# EAGLE board 612_jetracer_pico_300 (EAGLE 9.6.0)
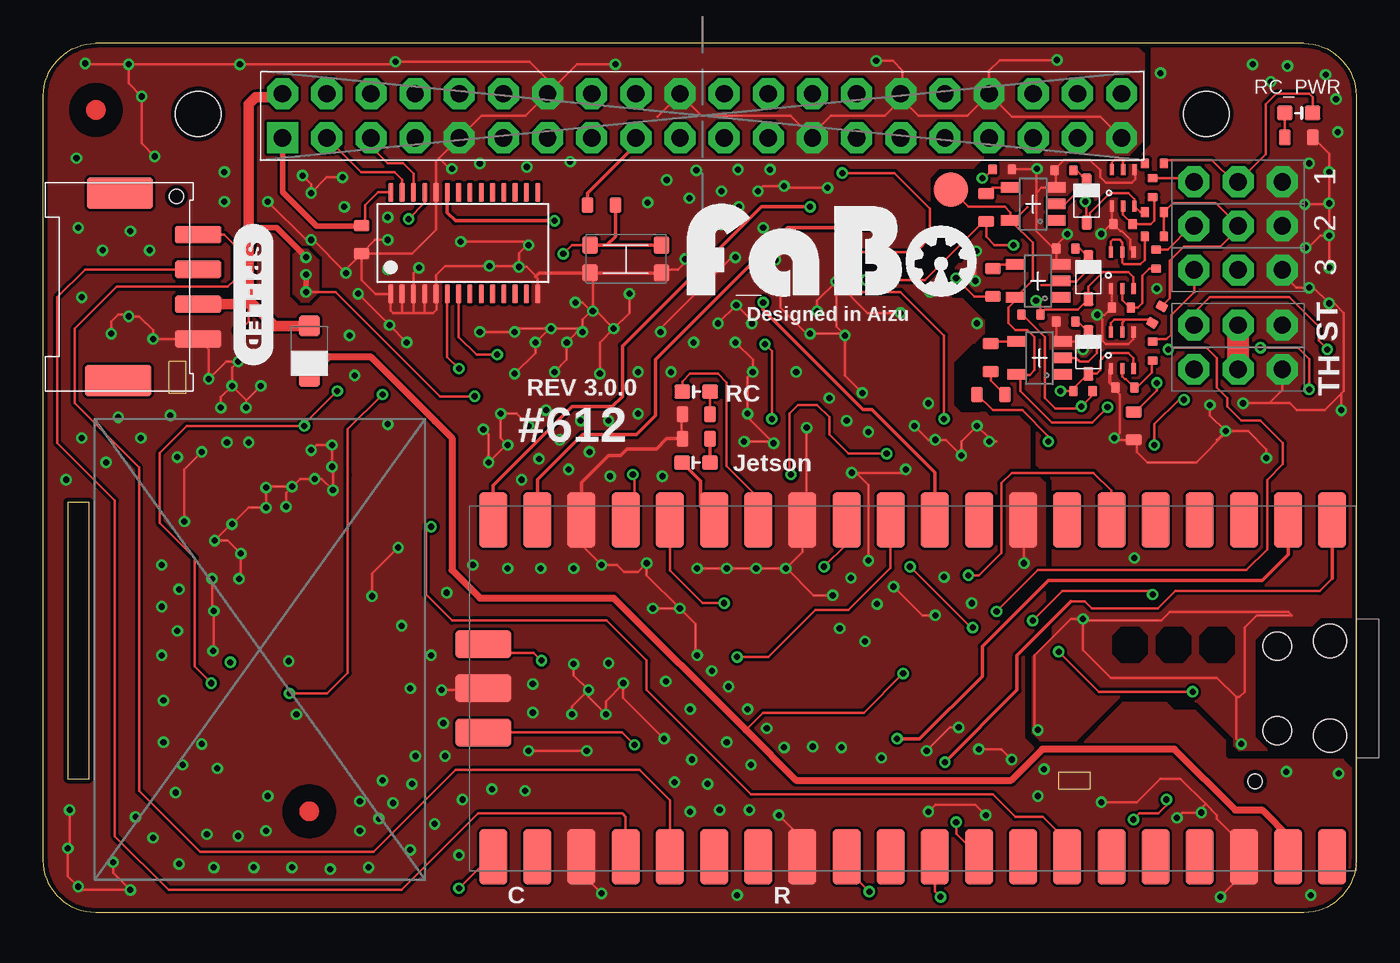
[diagram p7: board, top side]
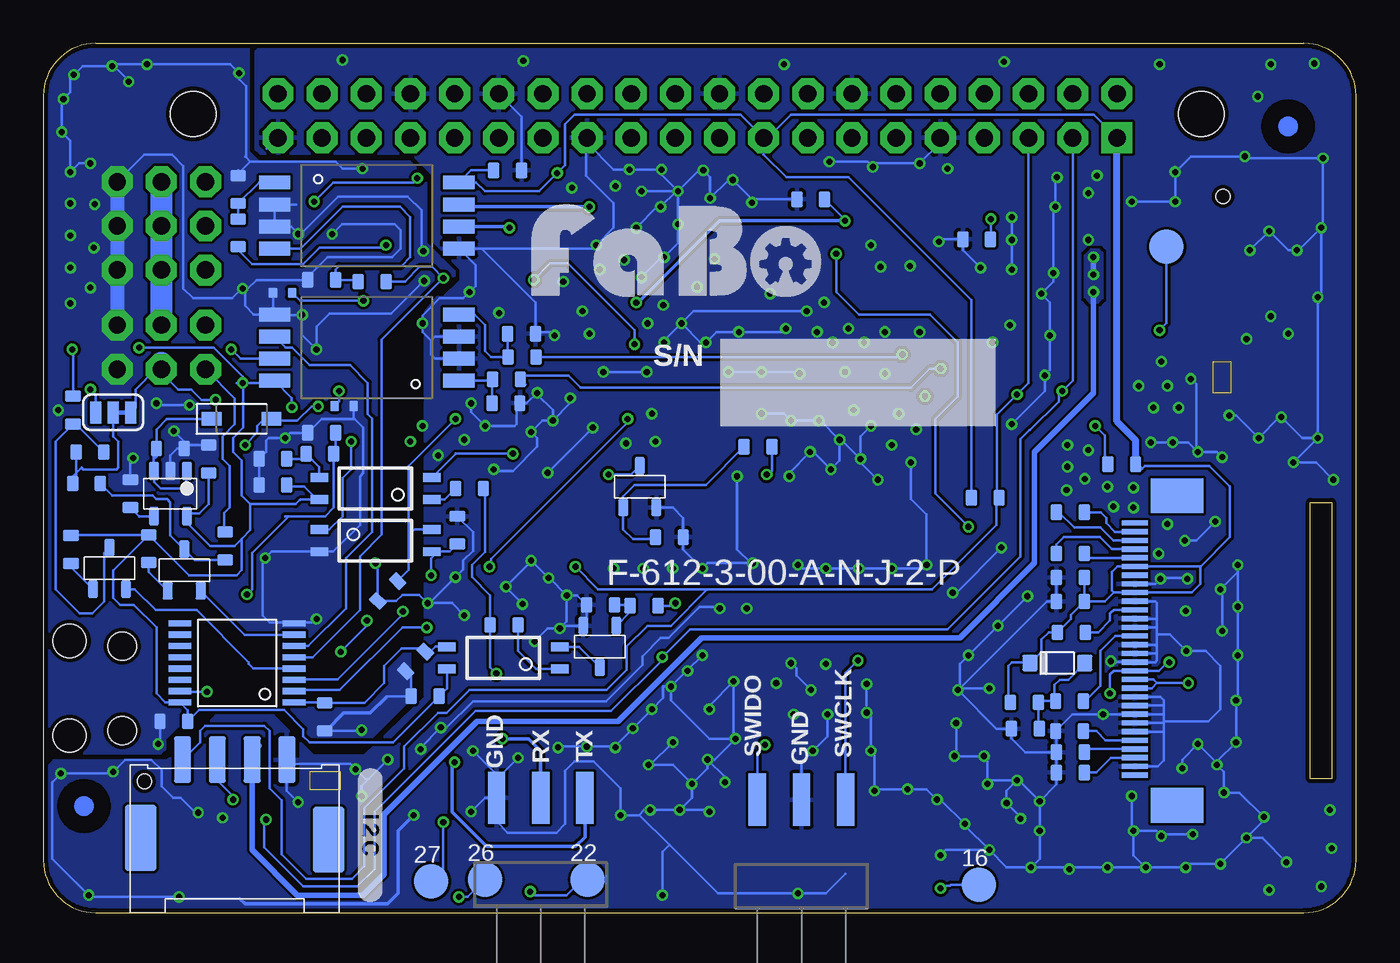
[diagram p8: board, bottom side, seen from below]

Size 75.5 x 50 mm. Coordinates in mm from the lower left corner, seen from the top.
Outline: 1.4,23.6 1.4,7.7 2.62,7.7 2.62,23.6 1.4,23.6
Outline: 72.5,0 3,0 arc-90 0,3 0,47 arc-90 3,50 72.5,50 arc-90 75.5,47 75.5,3 arc-90 72.5,0
Copper layers (1*16): Top 0.035mm / dielectric 1.6mm / Bottom 0.035mm
Design rules "PCBway": minimum track width 6mil, minimum drill 12mil, track to track 6mil, track to pad 6mil, pad to pad 6mil, via to via 6mil, smd to smd 6mil, copper to edge 10mil, drill to drill 10mil, minimum pad ring 10mil, minimum via ring 6mil, stop-mask expansion 2mil, vias tented up to drill 100mil, thermal gap 8mil
Holes 2.6 mm at 66.9,45.95 8.9,45.95
tKeepout: area 2.8,1.7 to 21.9,28.5; area 24.6,2.3 to 75.5,23.4
bKeepout: area 43,10.8 to 47,14.6
bRestrict: 7 lines

## Footprints (pad centres in the part's own frame; a part is rotated, then mirrored left to right if it is on the bottom)
FABO_BRICK_3PIN_HEADER = drill 1 pad 1.778 octagon: GND -2.54,0; I/O 2.54,0; VCC 0,0
TESTPAD_TP20R = smd 2 x 2: TP 0,0
0603 = smd 0.65 x 0.9: 1 -0.8,0; 2 0.8,0
1N4148W = smd 0.9 x 0.95: ANODE 0,0; CATHODE 3.15,0
SOD-323 = smd 0.8 x 0.6: A -1.2,0; K 1.2,0
SOD3715X135 = smd 1.127 x 0.784: 1 -1.722,0; 2 1.722,0
SOD123W = smd 1.2 x 1.2: 1 -1.45,0; 2 1.45,0
I2C-BM04B-PASS-1 = smd 1 x 2.7: 5V -1,0; GND -3,0; SCL 3,0; SDA 1,0 | smd 1.8 x 3.8: P$5 -5.4,4.6; P$6 5.4,4.5 | hole 0.8: 5.2,1.25
JETSON_NANO_NOBOARDER = drill 1 pad 1.778 square: 1 1.27,1.27 | drill 1 pad 1.778 octagon: 2 1.27,3.81; 3 3.81,1.27; 4 3.81,3.81; 5 6.35,1.27; 6 6.35,3.81; 7 8.89,1.27; 8 8.89,3.81; 9 11.43,1.27; 10 11.43,3.81; 11 13.97,1.27; 12 13.97,3.81; 13 16.51,1.27; 14 16.51,3.81; 15 19.05,1.27; 16 19.05,3.81; 17 21.59,1.27; 18 21.59,3.81; 19 24.13,1.27; 20 24.13,3.81; 21 26.67,1.27; 22 26.67,3.81; 23 29.21,1.27; 24 29.21,3.81; 25 31.75,1.27; 26 31.75,3.81; 27 34.29,1.27; 28 34.29,3.81; 29 36.83,1.27; 30 36.83,3.81; 31 39.37,1.27; 32 39.37,3.81; 33 41.91,1.27; 34 41.91,3.81; 35 44.45,1.27; 36 44.45,3.81; 37 46.99,1.27; 38 46.99,3.81; 39 49.53,1.27; 40 49.53,3.81
TSSOP-16 = smd 0.36 x 1.3: 1 -2.275,-3.28; 2 -1.625,-3.28; 3 -0.975,-3.28; 4 -0.325,-3.28; 5 0.325,-3.28; 6 0.975,-3.28; 7 1.625,-3.28; 8 2.275,-3.28; 9 2.275,3.28; 10 1.625,3.28; 11 0.975,3.28; 12 0.325,3.28; 13 -0.325,3.28; 14 -0.975,3.28; 15 -1.625,3.28; 16 -2.275,3.28
PCA9685 = smd 0.3 x 1.1: 1 -4.15,-2.93; 2 -3.5,-2.93; 3 -2.85,-2.93; 4 -2.2,-2.93; 5 -1.55,-2.93; 6 -0.9,-2.93; 7 -0.25,-2.93; 8 0.4,-2.93; 9 1.05,-2.93; 10 1.7,-2.93; 11 2.35,-2.93; 12 3,-2.93; 13 3.65,-2.93; 14 4.3,-2.93; 15 4.3,2.92; 16 3.65,2.92; 17 3,2.92; 18 2.35,2.92; 19 1.7,2.92; 20 1.05,2.92; 21 0.4,2.92; 22 -0.25,2.92; 23 -0.9,2.92; 24 -1.55,2.92; 25 -2.2,2.92; 26 -2.85,2.92; 27 -3.5,2.92; 28 -4.15,2.92
SOT-23-5 = smd 0.6 x 1.05: 1 -0.95,-1.3; 2 0,-1.3; 3 0.95,-1.3; 4 0.95,1.3; 5 -0.95,1.3
1X03_SMD_RA_MALE = smd 1 x 3: 1 -2.54,5; 2 0,5; 3 2.54,5
0603' = smd 0.9 x 0.8: ANODE -0.8,0; CATHODE 0.8,0
SMT-JUMPER_3_1-NC_TRACE_SILK = smd 0.635 x 1.27: 1 -1.016,0; 2 0,0; 3 1.016,0
SPI-BM04B-PASS-1 = smd 1 x 2.7: 5V -1,-0.1; CI 1,-0.1; DI 3,-0.1; GND -3,-0.1 | smd 1.8 x 3.8: P$5 -5.4,4.5; P$6 5.4,4.4 | hole 0.8: 5.2,1.15
0402 = smd 0.5 x 0.6: 1 -0.55,0; 2 0.55,0
KMR2 = smd 0.9 x 1: 1 -2.05,0.8; 2 2.05,0.8; 3 2.05,-0.8; 4 -2.05,-0.8
SOT-23 = smd 0.6 x 1: 1 -0.95,-1.2; 2 0.95,-1.2; 3 0,1.2
ER-CON30HT-1 = smd 0.3 x 1.5 bottom: 1 7,-0.23; 2 6.5,-0.23; 3 6,-0.23; 4 5.5,-0.23; 5 5,-0.23; 6 4.5,-0.23; 7 4,-0.23; 8 3.5,-0.23; 9 3,-0.23; 10 2.5,-0.23; 11 2,-0.23; 12 1.5,-0.23; 13 1,-0.23; 14 0.5,-0.23; 15 0,-0.23; 16 -0.5,-0.23; 17 -1,-0.23; 18 -1.5,-0.23; 19 -2,-0.23; 20 -2.5,-0.23; 21 -3,-0.23; 22 -3.5,-0.23; 23 -4,-0.23; 24 -4.5,-0.23; 25 -5,-0.23; 26 -5.5,-0.23; 27 -6,-0.23; 28 -6.5,-0.23; 29 -7,-0.23; 30 -7.5,-0.23 | smd 2 x 3 bottom: 31 -9.07,-2.67; 32 8.74,-2.67
RASPBERRY_PI_PICO_SMD = smd 3.2 x 1.6: 1 -9.69,24.13; 2 -9.69,21.59; 3 -9.69,19.05; 4 -9.69,16.51; 5 -9.69,13.97; 6 -9.69,11.43; 7 -9.69,8.89; 8 -9.69,6.35; 9 -9.69,3.81; 10 -9.69,1.27; 11 -9.69,-1.27; 12 -9.69,-3.81; 13 -9.69,-6.35; 14 -9.69,-8.89; 15 -9.69,-11.43; 16 -9.69,-13.97; 17 -9.69,-16.51; 18 -9.69,-19.05; 19 -9.69,-21.59; 20 -9.69,-24.13; 21 9.69,-24.13; 22 9.69,-21.59; 23 9.69,-19.05; 24 9.69,-16.51; 25 9.69,-13.97; 26 9.69,-11.43; 27 9.69,-8.89; 28 9.69,-6.35; 29 9.69,-3.81; 30 9.69,-1.27; 31 9.69,1.27; 32 9.69,3.81; 33 9.69,6.35; 34 9.69,8.89; 35 9.69,11.43; 36 9.69,13.97; 37 9.69,16.51; 38 9.69,19.05; 39 9.69,21.59; 40 9.69,24.13 | smd 1.6 x 3.2: D1 -2.54,-24.7; D2 0,-24.7; D3 2.54,-24.7 | hole 1.9: 2.725,24; -2.725,24 | hole 1.6: 2.425,20.97; -2.425,20.97
11-3C1 = smd 1 x 0.5: 1 -3.24,0.635; 2 -3.24,-0.635; 3 3.24,-0.635; 4 3.24,0.635
TLP2270 = smd 0.8 x 1.8: 1 -1.905,-5.3; 2 -0.635,-5.3; 3 0.635,-5.3; 4 1.905,-5.3; 5 1.905,5.3; 6 0.635,5.3; 7 -0.635,5.3; 8 -1.905,5.3
US6 = smd 0.3 x 0.635: 1 -0.65,-1.05; 2 0,-1.05; 3 0.65,-1.05; 4 0.65,1.05; 5 0,1.05; 6 -0.65,1.05
SOT-23' = smd 1.1 x 0.6: 1 -1.3,0.95; 2 -1.3,0; 3 -1.3,-0.95; 4 1.3,-0.95; 5 1.3,0.95

## Placement (x,y rotation side)
1  [FABO_BRICK_3PIN_HEADER]  68.72,42.05 180 top
2  [FABO_BRICK_3PIN_HEADER]  68.72,39.51 180 top
3  [FABO_BRICK_3PIN_HEADER]  68.72,36.97 180 top
16  TESTPAD_TPSQTP20R  [TESTPAD_TP20R]  21.7,1.6 0 bottom
22  TESTPAD_TPSQTP20R  [TESTPAD_TP20R]  44.2,1.9 0 bottom
26  TESTPAD_TPSQTP20R  [TESTPAD_TP20R]  50.1,1.9 0 bottom
27  TESTPAD_TPSQTP20R  [TESTPAD_TP20R]  53.2,1.8 0 bottom
C1  0.1uF  [0603]  62.3,24.6 0 bottom
C2  10uF  [0603]  18.3,38.72 90 top
C3  0.1uF  [0603]  68,11 0 bottom
C4  1uF  [0603]  16.43,20.66 180 bottom
C5  1uF  [0603]  16.43,23.03 0 bottom
C6  1uF  [0603]  16.43,17.91 0 bottom
C7  1uF  [0603]  16.43,19.28 0 bottom
C8  10uF  [0603]  16.43,8.05 0 bottom
C9  10uF  [0603]  16.43,9.23 0 bottom
C10  1uF  [0603]  68.2,26.7 180 bottom
C11  10uF  [0603]  19.02,10.58 0 bottom
C12  0.1uF  [0603]  53.55,12.45 0 bottom
C16  0.1uF  [0603]  48.8,42.7 180 bottom
C17  0.1uF  [0603]  62.7,28 90 top
C18  0.1uF  [0603]  55.7,18.5 45 bottom
C22  4.7uF  [0603]  66,26.1 270 bottom
C23  0.01uF  [0603]  70.5,24.1 270 bottom
D1  1N4148  [1N4148W]  15.6,14.36 180 bottom
D2  [SOD-323]  60.1,32.2 90 top
D3  [SOD-323]  60,40.9 90 top
D5  1N4148W  [SOD3715X135]  64.1,28.4 0 bottom
D6  [SOD-323]  60.1,36.5 90 top
D10  PMEG2010ER  [SOD123W]  15.3,32.3 90 top
I2C  FABO-I2C_BM04B  [I2C-BM04B-PASS-1]  64.5,8.8 180 bottom
IC2  JETSON_NANO_NOBORDER  [JETSON_NANO_NOBOARDER]  12.48,43.3 0 top
IC3  MULTIPLEXERSMC74HC157A  [TSSOP-16]  64.36,14.36 90 bottom
IC4  [PCA9685]  24.13,38.52 0 top
IC5  [SOT-23-5]  68.2,24.1 180 bottom
J1  [1X03_SMD_RA_MALE]  46.9,1.6 0 bottom
J2  [1X03_SMD_RA_MALE]  31.9,1.5 0 bottom
JETSON  GREEN  [0603']  37.54,25.89 0 top
JETSON1  RED  [0603']  37.55,29.97 0 top
JP2  JUMPER-SMT_3_1-NC_TRACE_SILK  [SMT-JUMPER_3_1-NC_TRACE_SILK]  71.49,28.77 0 bottom
LED-SPI  [SPI-BM04B-PASS-1]  8.8,36 90 top
R1  10K  [0603]  21.82,38.73 0 bottom
R2  220  [0603]  34.4,26.8 180 bottom
R3  10K  [0603]  31.37,41.03 0 bottom
R4  1K/0402  [0402]  63.9,43.1 0 top
R5  470  [0603]  37.55,28.66 0 top
R6  1K/0402  [0402]  63.9,40.3 0 top
R7  10K  [0603]  21.33,23.87 0 bottom
R8  100  [0603]  16.48,12.17 0 bottom
R9  10K  [0603]  13.48,25.8 180 bottom
R10  1K  [0603]  37.55,27.26 0 top
R11  0  [0603]  69.44,20.93 90 bottom
R12  220  [0603]  51,24.4 180 bottom
R13  10K  [0603]  39.5,21.6 0 bottom
R14  10K  [0603]  73.03,24.69 180 bottom
R15  1K/0402  [0402]  63.9,38.9 0 top
R16  10K  [0603]  59.33,11.26 90 bottom
R17  47  [0603]  73.8,28.91 270 bottom
R18  0  [0603]  73.92,20.89 90 bottom
R19  10K  [0603]  72.83,26.49 180 bottom
R20  47  [0603]  65.05,21.09 270 bottom
R21  1K/0402  [0402]  56.8,34.4 180 top
R22  10K  [0603]  16.38,16.12 0 bottom
R23  10K  [0603]  19.08,12.1 0 bottom
R24  4.7K/0402  [0402]  58.8,38.2 0 top
R25  0  [0603]  54.62,36.25 270 top
R26  1K/0402  [0402]  59.8,30 0 top
R27  4.7K/0402  [0402]  58.7,42.7 0 top
R28  100/0402  [0402]  63.8,41.7 270 top
R29  0  [0603]  54.23,40.56 270 top
R30  100/0402  [0402]  64,37.6 270 top
R31  4.7K/0402  [0402]  58.8,34 0 top
R32  0  [0603]  54.48,31.93 270 top
R33  330  [0603]  48.87,30.68 0 bottom
R34  330  [0603]  47.97,31.95 0 bottom
R35  390K  [0603]  16.48,10.44 180 bottom
R36  10K  [0603]  62.3,26.1 180 bottom
R37  100/0402  [0402]  63.8,32.3 270 top
R38  100K/0402  [0402]  62.1,39.6 0 top
R39  100K/0402  [0402]  62.2,30.2 0 top
R40  100K/0402  [0402]  62,34.8 0 top
R41  DNP  [0603]  32.1,40.7 180 top
R42  1K  [0603]  72.2,44.6 180 top
R43  330  [0603]  64.3,39.1 270 bottom
R44  330  [0603]  56.6,36.3 0 bottom
R45  220  [0603]  54.5,29.8 0 top
R46  4.7K  [0603]  51.7,22 270 bottom
R47  10K  [0603]  48.9,29.3 0 bottom
R48  10K  [0603]  48,33.3 0 bottom
R49  10K  [0603]  64.3,41.6 270 bottom
R50  10K  [0603]  59.5,36.4 0 bottom
R51  0  [0603]  59.5,27.6 0 bottom
R52  DNF  [0603]  59.6,26.4 180 bottom
R53  1K/0402  [0402]  64.05,34.4 60 top
R54  4.7K/0402  [0402]  55.15,42.75 180 top
R55  4.7K/0402  [0402]  61.75,35.65 0 bottom
R56  4.7K/0402  [0402]  58.2,29.15 180 bottom
R57  220  [0603]  40.95,17.65 180 bottom
R58  220  [0603]  49,16.55 0 bottom
R59  10K  [0603]  43.45,17.7 180 bottom
R60  10K  [0603]  54.1,14.45 225 bottom
RC_3V3  TESTPAD_TPSQTP20R  [TESTPAD_TP20R]  52.2,41.6 0 top
RC_PWR  ORANGE  [0603']  72.2,46 180 top
ST  [FABO_BRICK_3PIN_HEADER]  68.72,33.8 180 top
SW1  [KMR2]  33.5,37.6 180 top
T1  [SOT-23]  43.5,15.3 180 bottom
T2  [SOT-23]  41.2,24.5 0 bottom
TH  [FABO_BRICK_3PIN_HEADER]  68.72,31.25 180 top
TP1  TESTPAD_TPSQTP20R  [TESTPAD_TP20R]  10.9,38.3 0 bottom
U1  [ER-CON30HT-1]  12.96,14.91 270 top
U2  [RASPBERRY_PI_PICO_SMD]  50,12.9 270 top
U3  TLP291A  [11-3C1]  56.4,24.4 180 bottom
U4  TLP291A  [11-3C1]  49.05,14.65 180 bottom
U7  TLP291A  [11-3C1]  56.4,21.4 0 bottom
U$1  [MARK_POINT_3MM]  3.02,46.17 270 top
U$2  [MARK_POINT_3MM]  3.9,45.23 90 bottom
U$3  [MARK_POINT_3MM]  73.17,6.12 90 bottom
U$4  [LOGO_FABO_L_BOTTOM]  38.95,35 0 top
U$5  TLP2270  [TLP2270]  56.9,32.5 90 bottom
U$8  TLP2270  [TLP2270]  56.9,40.1 270 bottom
U$9  SSM6N7002KFU  [US6]  62.1,41.7 0 top
U$11  SSM6N7002KFU  [US6]  62.05,36.95 0 top
U$14  SN74LVC1G17  [SOT-23']  56.92,40.76 180 top
U$20  SN74LVC1G17  [SOT-23']  57.2,36.34 180 top
U$21  SSM6N7002KFU  [US6]  62.05,32.35 0 top
U$23  SN74LVC1G17  [SOT-23']  57.3,31.91 180 top
U$27  T2N7002AK  [SOT-23]  67.4,19.7 0 bottom
U$28  T2N7002AK  [SOT-23]  71.7,19.8 0 bottom
U$29  [MARK_POINT_3MM]  15.29,5.83 90 top
U$30  [LOGO_FABO_L]  44.65,35.45 0 top

## Tracks (layer width: path | path; a pad name or v marks a point on that pad's centre or on a via)
3V3  (via drill 0.35)
  Top 0.152: C2.2 18.3,39.5 | 18.5,39.6 18.5,40.7 19.24,41.44 IC4.28 | v51.8,28.4 51.8,33.2 49.3,35.7 47.1,35.7 46.4,36.4 46.4,37.5 46.9,38 50.2,38 51,38.8 51,40.5 48.95,42.55 v45.95,42.55
  Top 0.2: R41.2 31.3,41.4 34.08,44.17 IC2.17
  Top 0.305: IC2.1 13.76,41.45 15.7,39.5 18.3,39.5 18.41,39.5 18.5,39.6
  Bottom 0.152: 12.45,25.4 12.3,25.55 | 12.3,25.55 12.15,25.7 8.45,25.7 7.25,24.5 7.25,21.6 8.94,19.91 8.95,19.91 | 8.95,19.91 U1.25 13.74,19.91 14.05,19.6 14.05,18.52 13.94,18.41 | 8.95,19.91 8.95,18.9 9.44,18.41 U1.22 13.94,18.41 | R9.1 12.54,25.8 12.3,25.55 | IC2.17 34.1,44.55 | R23.1 20,12.21 20,14.2 19.8,14.4 18.79,14.4 D1.CATHODE 18.1,15.01 18.1,15.7 17.68,16.12 R22.1 16.4,16.9 16.4,17.13 C6.2 | C7.2 C6.2 | C6.2 14.45,17.91 13.94,18.41 | C16.2 50.91,42.7 U$8.8 50.6,42.01 50.1,41.5 47,41.5 v45.95,42.55 45.5,43 45.5,45.35 44.95,45.9 35.41,45.9 IC2.17 | IC2.17 34.08,43.6 32.77,42.3 29.2,42.3 22.13,35.23 R7.1 | 13.76,44.34 IC2.1 15.09,45.9 32.5,45.9 33.83,44.57 IC2.17 | C18.2 54.5,19.7 54.5,21.7 | 54.5,21.7 54.16,22.04 U7.4 | 54.5,21.7 54.5,25.7 v51.8,28.4
  Bottom 0.406: R9.1 12.68,27.18 13.76,28.25 IC2.1
5V  (via drill 0.35)
  Top 0.152: v24.8,29.7 22.8,29.7 16.8,35.7 v15.1,35.7 | v11.3,33.5 11.8,34 11.8,35.25
  Top 0.305: v15.1,35.7 v15.1,36.7 | v15.1,37.7 13.4,39.4 11.8,39.4
  Top 0.406: D10.2 15.1,33.95
  Top 0.61: IC2.2 13.54,46.9 12.2,46.9 11.8,46.5 11.8,39.4 11.8,35.25 | 11.8,35.25 11.55,35 LED-SPI.5V | D10.2 13.3,33.75 11.8,35.25
  Bottom 0.152: TP1.TP 10.9,33.9 v11.3,33.5
  Bottom 0.305: v15.1,35.7 15.1,29.9 18.5,26.5 18.5,20.1 22.8,15.8 37.65,15.8 42.45,11 50.55,11 55.9,5.65 55.9,2.2 57.1,1 60.9,1 63.5,3.6 I2C.5V 63.4,8.9 63.4,9.3 63.1,9.6 | v15.1,36.7 v15.1,37.7
  pour Top (no thermals): 14.85,35.15 14.4,35.6 14.4,37.85 14.7,38.15 15.2,38.15 15.8,37.55 15.8,35.7 15.25,35.15
  pour Bottom (no thermals): 14.6,35.35 14.6,37.95 14.8,38.15 15.25,38.15 15.6,37.8 15.6,35.4 15.3,35.1 14.85,35.1
CH1  (via drill 0.35)
  Top 0.152: R29.2 54.23,39.6 | 54.23,39.6 54.23,38.88 54.7,38.4 v55.8,38.4 | 54.23,39.6 54.06,39.76 50.7,36.4 v47.3,36.4 | v41.9,28.4 41.9,32.3 v41.5,32.7 | v49.85,19.9 53.35,16.4 v53.45,16.4
  Bottom 0.152: R43.2 64.3,38.1 63.5,37.3 60.55,37.3 59.6,38.25 55.95,38.25 v55.8,38.4 | 61.22,12.6 IC3.2 61.02,12.8 58.45,12.8 54.85,16.4 v53.45,16.4 | v41.5,32.7 41.5,33.5 45.35,37.35 46.35,37.35 v47.3,36.4 | v41.9,28.4 41.9,28.2 49.75,20.35 49.75,20 v49.85,19.9
CH2  (via drill 0.35)
  Top 0.152: 54.65,35.41 R25.2 53.55,35.45 v52.5,36.5
  Bottom 0.152: IC3.5 60.02,14.69 57.3,17.4 57.3,20.5 56.05,21.75 56.05,32.95 v52.5,36.5 53.15,37.15 53.85,37.15 54.7,36.3 R44.2
CH3
  Top 0.152: 54.27,31.12 R32.2 54.48,30.61 R45.2
D3
  Top 0.152: JETSON1.ANODE 36.75,30.55 37.2,31 38.8,31 39.3,30.5 39.3,25.7 41.11,23.89 U2.14
  Top 0.2: U2.14 40.8,22.9
D4
  Top 0.2: U2.15 37.8,23.36 37.8,24.82 JETSON.ANODE
EN
  Bottom 0.152: U3.3 59.64,25.64 R52.2 60.7,26.1 R36.1
GND  (via drill 0.35)
  Top 0.152: 49.31,46.47 49.31,46.75 | 49.31,46.75 49.31,46.85 | 49.31,46.85 IC2.30 | IC2.34 53.13,45.85 50.31,45.85 49.41,46.76 | 49.41,46.76 49.31,46.85 | IC2.34 55.7,45.8 60.78,45.8 IC2.39 62.05,44.6 | IC2.25 44.23,44.78 45.3,45.85 48.41,45.85 49.31,46.75 | IC2.25 42.95,45.85 37.85,45.85 36.62,47.09 | 36.62,47.09 IC2.20 | 35.33,45.8 36.62,47.09 | 28.94,47.06 27.73,45.85 25.2,45.85 IC2.9 22.75,43.4 | 28.94,47.06 IC2.14 30.68,48.8 v32.9,48.8 | 44.23,44.37 IC2.25 | v11.25,19.2 11.35,19.3 v11.35,20.65 10.6,21.4 v9.85,21.4 10.8,22.35 v10.85,22.35 11.8,23.3 v12.8,23.3 v12.8,24.45 12.85,24.5 v14.3,24.5 | v9.7,19.2 9.7,17.45 v9.8,17.35 9.8,15.1 v9.75,15.05 | C2.1 18.3,36.4 19.11,35.59 IC4.1 19.98,34.62 20.1,34.5 20.6,34.5 | 20.6,34.5 21.3,34.5 | 21.3,34.5 21.9,34.5 | 21.9,34.5 22.4,34.5 22.6,34.7 22.6,35.57 IC4.5 22.58,36.68 23.1,37.2 v25.65,37.2 27.3,37.2 v27.35,37.15 | IC4.4 21.93,34.53 21.9,34.5 | 21.3,34.5 21.28,34.52 IC4.3 21.28,36.78 v21.6,37.1 | IC4.2 20.63,34.53 20.6,34.5 | 28.3,36.6 28.43,36.47 IC4.14 | 25.4,13 U2.D2 25.2,12.8 v22.9,12.8 | 22.75,43.4 22.58,43.23 IC4.24 22.58,39.28 21.21,37.91 C2.1 | U2.13 43.65,22.4 | 43.65,22.4 43.65,20.75 42.73,19.82 | 42.73,19.82 v42.7,19.8 v41,19.8 v39.3,19.8 v37.6,19.8 | U2.18 30.95,21.15 v32.1,20 33,20 33.4,19.6 34.2,19.6 v34.7,20.1 34.7,19.4 v36.6,17.5 | v43.9,27.9 43.9,22.65 43.65,22.4 | v56.4,20.1 56.4,22.54 U2.8 | v47.1,29.9 46.1,30.9 v46.1,33.2 | v67.7,0.9 69.05,2.25 U2.38 69.05,3.85 67.5,5.4 67.5,5.6 66.85,6.25 | v50.9,5.8 51.3,6.2 53.6,6.2 v54.2,5.6 | v42.3,5.6 43.65,4.25 U2.28 | v32.1,1.1 30.95,2.25 U2.23 | v49.6,25.5 49.4,25.3 46.75,25.3 | 46.75,25.3 v46.5,25.3
  Top 0.152: v8.1,22.5 8.1,25.5 v9.1,26.5 | SW1.2 31.6,36.65 31.6,34.7 | 31.6,34.7 v31.6,34.6 31.8,34.6 v32.8,33.6 | v1.5,5.9 1.5,3.8 v1.4,3.7 1.4,2.1 v2,1.5 2.2,1.3 v5,1.3 4,2.3 v4,2.9 | R5.1 36.7,28.61 36.7,27.26 | v12.9,40.9 15.1,38.7 v15.4,38.7 15.5,38.7 17.3,36.9 | 17.3,36.9 v17.4,36.8 | v14.9,42.4 15.4,41.9 v15.4,41.4 16.3,42.3 v17.2,42.3 | C2.1 19.09,38.7 v19.8,38.7 | v10.85,30.3 10.85,31.35 v11.2,31.7 10.5,31.7 v9.5,30.7 9.5,32.4 LED-SPI.GND v6.3,33 6.3,33.5 5.5,34.3 v4.9,34.3 4.8,34.4 4.3,34.4 3.9,34 v3.9,33.3 | v20.9,32.8 v19.9,33.8 v18.1,35.6 | v25.1,33.4 v27.1,33.4 27.3,33.6 v29.2,33.6 | v29.2,33.6 30.8,33.6 v31,33.4 | v31,33.4 31,34.1 31.5,34.6 | 31.5,34.6 31.6,34.7 | v33.7,35.6 33.7,34.5 v32.8,33.6 | v35.5,33.4 35.5,33.6 v37.9,36 39.6,37.7 v39.8,37.7 | v45.1,41.7 42.7,41.7 v42.6,41.8 41.4,41.8 v41.1,41.5 | v46.1,33.2 46,33.3 v44.1,33.3 43.9,33.3 42.4,34.8 42.4,36.1 41.95,36.55 v41.1,36.55 | v46.1,33.2 45.6,33.7 v45.6,36.3 | v25.3,27.8 25.6,27.5 v25.6,25.9 26.6,26.9 v26.7,26.9 26.3,27.3 v26.3,28.7 27.2,28.7 v27.9,28 28.8,28.9 v28.9,28.9 | v50.1,28 50.9,27.2 v51.3,27.2 51.9,27.2 v52.8,26.3 52.8,27.1 v53.7,28 54.4,27.3 v54.4,27.1 54.8,27.1 | SW1.1 35.75,37 36.5,37 36.9,37.4 v36.9,37.6 | v24,38.6 27.7,38.6 27.85,38.45 | 27.85,38.45 v27.9,38.4 | v30.6,35.1 31,35.1 31.5,34.6 | v18.9,18.2 18.9,19.5 v20.4,21 | v36.6,17.5 37.5,16.6 37.5,14.7 v37.6,14.8 | C2.1 18.3,37.91 17.3,36.9 | v29.2,33.6 29.1,33.6 v28.3,32.8 28.3,32.2 v27.1,31 | v31,33.4 30.7,33.4 v30.1,32.8 30.1,31.8 v29.4,31.1 | v49.3,34.5 47.4,34.5 v45.6,36.3 | v44.5,34.6 44.5,35.2 v45.6,36.3 | v39.8,32.8 40.8,31.8 v40.8,31.1 40.5,30.8 v40.5,28.7 40.5,28.5 v42,27 41.9,27.1 v40.3,27.1
  Top 0.152: v32,31 32,32.8 v32.8,33.6 | v38.8,33.9 v39.85,34.95 40.75,34.05 v40.75,33.9 | v42.1,37.55 42.95,38.4 43.55,38.4 | 43.55,38.4 v43.7,38.4 | v43.5,37 43.55,37.05 43.55,38.4 | v23.5,42.8 23.35,42.8 22.75,43.4 | v6.4,43.5 5.65,44.25 v5.65,46.95 4.9,47.7 v4.9,48.8 | v4.9,48.8 2.45,48.8 v2.4,48.85 | v4.9,48.8 v11.3,48.8 20.1,48.8 v20.25,48.95 27.95,48.95 28.94,47.96 28.94,47.06 | v27.35,37.15 27.35,37.95 27.85,38.45 | v27.35,37.15 27.8,37.15 28.32,36.62 | v31.25,9.3 v27.9,9.3 | v31.35,12.8 30.5,13.65 v30.5,14.3 | v30.4,11.4 30.4,11.85 v31.35,12.8 | v31.35,12.8 31.35,12.4 v32.35,11.4 32.35,12.15 33.35,13.15 | 33.35,13.15 33.35,12.35 v35.7,10 | 33.35,13.15 v33.35,13.2 | v35.05,17.5 v36.6,17.5 | v47.9,49 48.85,49 49.41,48.44 49.41,46.76 | IC2.34 54.4,48.45 55,49.05 v58.3,49.05 | v14.3,24.5 13.95,24.15 v13.95,23.35 | v14.3,24.5 14.75,24.95 v15.6,24.95 16,24.95 v16.65,24.3 16.65,25.6 v16.6,25.65 v16.6,26.9 15.7,26.9 v15.4,26.6 | v10.2,29.05 10.2,29.65 v10.85,30.3 | v10.85,30.3 11.65,29.5 v11.65,29.05 11.65,29.45 v12.5,30.3 | v45.4,18.25 44.3,18.25 42.73,19.82 | v60.85,6.35 62.9,6.35 64.25,7.7 65.4,7.7 66.85,6.25 | 66.85,6.25 66.6,6 v66.6,5.75 65.5,5.75 v65.2,5.45 | v53.8,9.4 55.1,9.4 v55.7,8.8 | v51.3,17.1 50.55,17.1 v48.9,18.75 | 46.75,25.3 47.45,24.6 v47.45,20.25 | v50.8,9.3 52.14,10.64 v52.64,10.64
  Top 0.2: U2.18 30.95,24.75 32.5,26.3 33.2,26.3 33.56,26.66 35.25,26.66 35.85,27.26 36.7,27.26 R10.1 | SW1.1 SW1.2 28.5,36.8 28.32,36.62 28.3,36.6
  Bottom 0.152: U1.10 11.25,12.4 11.05,12.2 11.05,11.9 | 11.05,11.9 11.05,11.4 | 11.05,11.4 11.06,11.41 U1.8 v14.55,11.4 16.32,11.4 R35.2 17.23,10.38 C9.1 | U1.9 11.06,11.91 11.05,11.9 | 11.45,15.3 11.45,14.9 | 11.45,15.3 11.56,15.41 U1.16 | U1.15 11.46,14.91 11.45,14.9 | 11.45,15.3 11.45,16 | 11.45,16 11.45,16.4 | 11.45,16.4 11.45,16.9 | 11.45,16.9 11.45,17.8 11.55,17.9 U1.21 | U1.18 11.45,16.4 | U1.19 11.45,16.9 | U1.23 11.55,18.9 v11.25,19.2 11.2,19.25 9.95,19.25 9.9,19.2 v9.7,19.2 | 62.65,43.94 IC2.39 | 11.45,14.9 11.45,14.5 11.55,14.4 U1.14 14.04,14.41 v14.1,14.47 | 23.91,44.84 IC2.9 23.91,44.28 v25.1,43.1 27.6,43.1 v27.8,42.9 28.1,43.2 v30.3,43.2 | 11.45,16 10.7,16 v9.75,15.05 8.65,15.05 7.8,14.2 7.8,11.7 8.5,11 11.05,11 | 17.36,19.15 C7.1 C6.1 17.8,17.91 22.8,12.9 | v8.1,22.5 9.2,21.4 v9.85,21.4 | C9.1 19.03,9.23 19.82,10.03 C11.1 20.68,10.58 22.85,12.75 | C9.1 C8.1 17.23,7.38 v18.2,6.4 | C16.1 48,45.8 IC2.30 | 11.05,11.4 11.05,11 | 11.05,11 11.05,10.9 | U1.6 11.05,10.41 | U1.7 11.05,10.9 | 11.05,10.9 11.05,10.41 | 11.05,10.41 11.05,8.75 11.4,8.4 U1.2 | v21.6,37.1 22.62,38.12 R1.1 23.86,38.73 v24,38.6 | U$5.3 52.97,33.13 53.2,32.9 | 53.2,32.9 53.2,32.1 52.97,31.86 U$5.2 | v56.4,20.1 56.27,19.97 C18.1 55.2,17.93 54.86,18.28 53.88,18.28 v53.4,17.8 | R48.2 47.2,33.4 | 47.2,33.4 47.2,35.1 50.3,38.2 | 50.3,38.2 U$8.5 50.65,37.25 50.65,36.05 v51,35.7 51.35,35.35 52.7,35.35 53.7,34.35 v53.7,33.9 53.7,33.4 53.2,32.9 | 50.3,38.2 43.91,38.2 v43.7,38.4 42.7,39.4 42.7,40.8 44.3,42.4 44.3,44.51 IC2.25 44.23,44.28 42.7,42.75 v41.8,42.75 v39.95,42.75 39.95,42.45 v39,41.5 | T2.2 39.3,23.3 38.7,22.7 R13.2 38.7,20.9 v37.6,19.8 37.3,20.1 34.8,20.1
  Bottom 0.152: v46.1,33.2 46.3,33.4 47.2,33.4 | v46.5,25.3 v43.9,27.9 | 64.2,0.8 67.6,0.8 v67.7,0.9 72.8,0.9 v72.9,1 75,3.1 75,7.5 v74.5,8 71.6,8 v71.5,8.1 70.8,8.8 69.3,8.8 68.7,8.2 68.7,7.25 68.05,6.6 67.6,6.6 66.75,5.75 v66.6,5.75 | J1.1 50.1,6.6 v50.9,5.8 | J1.1 49.44,5.24 48.8,4.6 46,4.6 45.5,5.1 45.5,8.15 44.95,8.7 43.85,8.7 42.3,7.15 v42.3,5.6 41.25,5.6 | 41.25,5.6 41.2,5.6 39.5,3.9 | 39.5,3.9 36.7,1.1 v32.1,1.1 30.5,1.1 29.36,2.24 | 22.85,12.75 v22.9,12.8 22.8,12.9 | v35.7,10 37.2,10 39.4,12.2 v39.4,13 | v49.6,25.5 49.5,25.4 48.5,25.4 47.1,26.8 47.1,27.3 v47.45,27.65 46.8,28.3 v46.2,28.3 | v9.1,26.5 9.2,26.6 9.2,30.4 v9.5,30.7 | R46.1 50.8,21.9 50.8,20.8 51.35,20.25 51.35,19.75 v51.8,19.3 53.3,17.8 v53.4,17.8 | v31.6,34.6 38.1,34.6 v38.8,33.9 | v55.7,8.8 56.8,7.7 | 56.8,7.7 57.2,7.3 v57.2,6.7 | J1.1 49.44,7.94 v50.8,9.3 | v34.7,20.1 34.8,20.1 | v32.1,20 31.9,19.8 v30.5,19.8 v28.6,19.8 v26.7,19.8 24.9,19.8 v24.7,20 24.7,22.9 25.6,23.8 v25.6,25.9 | v37.2,5.8 37.3,5.9 v38.9,5.9 | v38.9,5.9 38.2,6.6 v38.2,7.4 | v38.2,7.4 37.3,8.3 v37.3,8.8 | v36.3,7.5 36.3,7.8 v37.3,8.8 | v37.3,8.8 36.9,8.8 v35.7,10 | v35.7,10 35.8,10.1 v35.8,13.3 37.2,11.9 v37.2,11.7 | v38.2,7.4 39.3,8.5 v40.7,8.5 40.6,8.5 v39.3,9.8 | v39.4,13 39.85,13 39.85,12.35 v40.5,11.7 v41.6,10.6 42.6,9.6 v42.6,9.5 42.65,9.55 v44.25,9.55 45.85,9.55 v45.9,9.5 | v4,2.9 5.4,4.3 v6.3,4.3 | v6.3,4.3 5.3,5.3 v5.3,5.5 6.7,6.9 v7.6,6.9 7.6,8.1 v8,8.5 8,8.6 | v6.3,4.3 v7.8,2.8 9.6,2.8 v9.8,2.6 v12.1,2.6 12.2,2.7 | 12.2,2.7 12.8,3.3 v12.8,4.7 | 12.2,2.7 12.3,2.6 v14.3,2.6 16.4,2.6 v16.5,2.5 16.6,2.6 v18.7,2.6 | v18.7,2.6 18.2,3.1 v18.2,4.7 v18.2,6.4
  Bottom 0.152: v19.5,7.6 21,7.6 v21.2,7.4 21.2,8.8 v21.4,9 23,9 | 23,9 v23.1,9 | v21.1,3.6 22.5,5 v22.5,5.1 23.9,6.5 v24.1,6.5 24.7,7.1 v25.8,7.1 27.6,7.1 v27.7,7 27.7,9.1 v27.9,9.3 27.9,11.25 v28.15,11.5 v28.15,13.15 | v21.1,3.6 20.1,2.6 v18.7,2.6 | v21.1,3.6 23.6,3.6 v23.9,3.3 | 32.4,14.45 v32.5,14.35 32.2,14.05 32.2,13.65 v31.35,12.8 | v21.1,12.9 22.7,12.9 22.85,12.75 | 22.8,12.9 22.8,14.3 v22.3,14.8 v20.6,16.5 v18.9,18.2 | 8,8.6 v9.1,9.7 10,8.8 v10,8.3 | 8,8.6 8,8.7 v6.9,9.8 v6.9,12.2 6.8,12.3 v6.8,14.8 v6.8,17.6 v6.8,20 6.8,19.6 v7.8,18.6 7.7,18.5 v7.7,16.2 | v1.3,24.9 2.3,25.9 v3.6,25.9 v2.2,27.3 | v2.2,27.3 3.1,27.3 v4.3,28.5 4.4,28.5 v5.6,27.3 6.9,28.6 v7.3,28.6 | v2.2,27.3 v2.2,35.4 2,35.6 v2,39.4 | v2,39.4 3.3,38.1 v3.4,38.1 3.9,38.1 v5,39.2 v6.1,38.1 | v2,39.4 1.9,39.5 v1.9,43.4 6.3,43.4 v6.4,43.5 9.5,43.5 v10.4,42.6 v10.4,40.9 v12.9,40.9 | v17.2,42.3 17.3,42.2 v17.3,40.6 17.4,40.5 v17.4,36.8 17.4,36.3 v18.1,35.6 17.6,35.1 v17.6,33.2 17.6,31.2 v17.9,30.9 17.9,30 v19.8,28.1 | v19.8,37 v19.8,38.7 v19.8,40 | v32.8,33.6 33,33.4 v35.5,33.4 36.8,33.4 v37.4,32.8 37.7,32.8 v38.8,33.9 | v38.8,33.9 39.8,32.9 v39.8,32.8 | v39,41.5 v39,39.6 39,38.5 v39.8,37.7 39.95,37.7 v41.1,36.55 | v39,41.5 v41.1,41.5 | v39,41.5 39.1,41.5 v40,40.6 40.2,40.6 v41.4,39.4 | v27.9,28 28.5,27.4 v28.5,26.1 | v28.5,26.1 29.6,27.2 v29.7,27.2 | v29.7,27.2 30.8,28.3 v30.9,28.3 v32.5,28.3 32.9,28.7 v34.2,28.7 | v28.5,26.1 28.5,25.9 v27.5,24.9 | v29.7,27.2 29.7,26 v30.2,25.5 31.2,26.5 v31.4,26.5 32.6,25.3 v32.6,25.1 | v35.6,25.1 35.6,20.9 34.8,20.1 | v36.6,17.5 36.67,17.57 | 36.67,17.57 36.7,17.6 | v46.2,28.3 45.2,29.3 v45.2,29.6
  Bottom 0.152: v46.2,28.3 46.2,28.9 47.1,29.8 v47.1,29.9 47.7,29.3 R47.2 48.3,29.1 48.3,28.1 48.4,28 v50.1,28 50.9,28.8 v50.9,29.3 | v20.4,21 23,18.4 v23.2,18.4 | 38.45,13.95 v37.6,14.8 | 38.45,13.95 v38.45,13.9 | 38.45,13.95 v39.4,13 | v39.9,1 39.9,3.5 39.5,3.9 | v48.2,8.9 49.44,7.66 J1.1 | v40.8,31.1 v43.3,31.1 | v32,31 32.1,31.1 v34.2,31.1 v36.1,31.1 | v9.4,4.5 11.1,4.5 v11.2,4.4 11.5,4.7 v12.8,4.7 | v12.8,4.7 12.9,4.8 v12.9,6.7 | v18.2,6.4 19.4,7.6 v19.5,7.6 | v19.5,7.6 20.1,7 v20.1,6.3 19.3,5.5 v19.3,5.4 | v23,10.9 23,9 | v38.9,5.9 v40.6,5.9 40.95,5.9 41.25,5.6 | R3.1 34.56,41.03 v34.75,40.85 34.75,41.05 v35.85,42.15 36.1,42.15 v37.15,41.1 37.15,42.3 v37.55,42.7 37.8,42.7 v39,41.5 | J2.2 31.9,8.65 v31.25,9.3 30.4,10.15 v30.4,11.4 | v7.7,26.2 8,26.5 v9.1,26.5 | v9.1,26.5 9.65,27.05 v10.55,27.05 v11.8,27.05 | v45.4,18.25 44.8,18.25 R59.2 44.25,16.7 T1.2 45.65,16.5 v45.8,16.35 | 36.67,17.57 37.77,17.57 39.55,15.8 40,15.8 41.05,14.75 41.05,14.25 43.15,12.15 50.8,12.15 52.31,10.64 v52.64,10.64 53.8,9.49 v53.8,9.4 | v60.85,6.35 61.5,7 I2C.GND 61.25,8.55 57.85,8.55 v57.55,8.25 57,7.7 56.8,7.7 | v47.25,15.6 46.5,16.35 v45.8,16.35 | v45.8,16.35 45.4,16.75 v45.4,18.25 | v45.4,18.25 46.4,19.25 v46.45,19.25 v47.45,20.25 47.45,20.2 v48.9,18.75 48.9,18.7 v47.95,17.75 | v51.3,17.1 52,17.8 v53.4,17.8
  Bottom 0.2: v54.2,5.6 55.1,4.7 55.1,1.1 55.7,0.5 63.9,0.5 64.2,0.8
  pour Bottom (rank 6): 0,50.3 62.55,50.3 63.3,49.55 63.3,43.9 63.05,43.65 54.35,43.65 53.1,42.4 53.1,38.6 51.5,37 51.5,36.4 52.5,35.4 52.85,35.4 53.55,34.55 53.55,12.4 57.05,9.05 59.95,9.05 62.25,11.35 65.6,11.35 66.75,10.2 67.65,10.2 68.1,9.75 68.1,9.05 68.4,8.75 74.9,8.75 75.55,8.1 75.55,1.65 73.65,-0.25 1.5,-0.25 0,2.35
  pour Top (rank 6, no thermals): -1.75,49.15 -0.1,50.8 61.9,50.8 63.3,49.4 63.3,44.45 62.45,43.6 54.25,43.6 53.5,42.85 51.55,42.85 50.95,42.25 50.95,40.75 51.45,40.25 51.65,40.25 51.7,40.2 52.8,40.2 52.8,38.2 51.5,36.9 51.5,36.1 52.3,35.3 52.85,35.3 54.1,34.05 54.1,33.35 53.55,32.8 53.45,32.8 52.3,31.65 52.3,29.2 52.8,28.7 53.85,28.7 53.9,28.75 54.2,28.75 54.45,28.5 56.15,28.5 56.7,27.95 56.7,25.6 57.6,24.7 57.6,15.9 56.4,14.7 56.4,10.05 57.25,9.2 59.25,9.2 62.1,12.05 64.6,12.05 65.05,11.6 66.25,11.6 67.95,9.9 67.95,9 68.15,8.8 74.75,8.8 75.65,7.9 75.65,1.55 73.65,-0.45 1.1,-0.45 -1.75,2.4
J_CH1  (via drill 0.35)
  Top 0.152: v64.7,32.4 64.8,32.5 66.9,32.5 67.5,31.9 67.5,30.2 68.1,29.6 68.1,29.1 68.9,28.3 70,28.3 71.3,27 71.3,25.8 70.4,24.9 70.4,20.9 69.2,19.7 57.2,19.7 v54.83,17.33
  Bottom 0.152: v64.7,32.4 64.17,31.86 U$5.7 | IC3.3 61.04,13.43 58.58,13.43 54.83,17.18 v54.83,17.33
J_CH2
  Bottom 0.152: U$5.6 61.56,32.49 61.2,32.49 60.2,31.49 57.86,31.49 56.84,30.48 56.84,28.68 56.59,28.43 56.59,21.91 58.1,20.4 58.1,17.5 60.27,15.34 IC3.6
LED_MOSI
  Top 0.152: U2.25 36.03,6.47 34.3,8.2 23.7,8.2 19,3.5 9,3.5 5.5,7 5.5,25.6 1.8,29.3 1.8,33.6 4.2,36 10.6,36 11,36.4 11,38.4 10.4,39 LED-SPI.DI
LED_SCK
  Top 0.152: U2.24 33.49,5.51 33.3,5.7 25,5.7 20.6,1.3 7.2,1.3 4.1,4.4 4.1,23.7 0.8,27 0.8,35.4 2.4,37 LED-SPI.CI
MLITI_SEL  (via drill 0.35)
  Top 0.152: v39.15,17.8 37.9,17.8 36.03,19.67 U2.16
  Bottom 0.152: R57.1 39.3,17.65 v39.15,17.8
N$2
  Top 0.152: U$9.2 62.1,40.15 R38.2 63.7,39.6 63.9,39.8 63.9,41.05 R28.2
N$3
  Bottom 0.152: R20.2 66.79,20.29 U$27.3 68.2,21.7 68.2,23.6 68.39,23.8 69.03,23.8 69.23,24 71.53,24 R14.1
N$5  (via drill 0.35)
  Top 0.152: v47.5,1.2 46.19,2.51 U2.29
  Bottom 0.152: 22.TP 44.5,1.9 45.4,1 47.3,1 v47.5,1.2
N$6  (via drill 0.35)
  Top 0.152: v33.9,25.2 34,25.1 34,22.6 33.4,22 33.4,22.5 U2.17
  Bottom 0.152: R2.1 33.6,25.4 33.8,25.2 v33.9,25.2
N$7  (via drill 0.35)
  Top 0.152: U2.34 58.4,3.7 58.4,4.6 57.5,5.5 55.9,5.5 54.6,6.8 40.7,6.8 34.7,12.8 34.7,14.5 32.4,16.8 23.5,16.8 22,18.3 22,21.9 v22.3,22.2 | v29.9,37.9 30.4,38.4 31.6,38.4
  Top 0.2: R41.1 32.9,38.9 32.4,38.4 | 32.4,38.4 31.6,38.4 SW1.3 | SW1.4 32.4,38.4
  Bottom 0.152: v22.3,22.2 24.2,24.1 24.2,28.4 22.9,29.7 22.9,32.8 24.5,34.4 28.6,34.4 29.9,35.7 v29.9,37.9
N$8  (via drill 0.35)
  Top 0.152: IC4.25 21.93,40.83 v21,39.9
  Bottom 0.152: v21,39.9 21,38.76 R1.2
N$9
  Bottom 0.152: U$27.1 69.44,19.59 R11.1
N$10  (via drill 0.35)
  Top 0.152: ST.I/O 66.18,34.48 67.1,35.4 71.65,35.4 73.35,33.7 73.35,32.9 v73.84,32.4
  Bottom 0.152: v73.84,32.4 73.8,32.36 R17.1
N$11
  Top 0.152: U$11.2 62.05,35.25 62.5,34.8 R40.2 62.95,34.8 63.2,35.05 63.2,36.65 63.6,37.05 R30.2
N$12  (via drill 0.35)
  Top 0.152: R6.1 63.1,40.3 U$9.3 62.75,41.05 62.4,41.4 61.35,41.4 60.2,40.25 60.2,39.9 D3.A 60,40.84 v59.93,40.9 | R54.2 54.1,42.25 v54,42.25
  Bottom 0.152: v59.93,40.9 58.84,42 54.25,42 v54,42.25
N$13
  Top 0.152: 2.I/O 66.03,39.51 64.67,38.15 R30.1
N$14
  Bottom 0.152: 64.8,22.14 R20.1 65.1,21.94 65.1,23 64.8,23.3 64.8,25.7 65.2,26.1 65.2,27.4 64.5,28.1 64.5,29.57 TH.I/O
N$15  (via drill 0.35)
  Top 0.152: v51.6,0.9 51.27,1.23 U2.31
  Bottom 0.152: 26.TP 51.1,0.9 v51.6,0.9
N$16
  Bottom 0.152: U1.27 14.06,20.91 14.75,21.6 16.8,21.6 17.23,21.18 C4.2
N$17
  Bottom 0.152: U$28.1 73.92,19.87 R18.1
N$18
  Top 0.152: U$11.6 61.4,38.6 61.5,38.7 61.9,38.7 62.05,38.55 U$11.5 62.05,37.4 62.15,37.3 63.1,37.3 63.35,37.55 R15.1
N$19
  Top 0.152: 38.46,29.86 JETSON1.CATHODE R5.2
  Top 0.2: JETSON1.CATHODE 38.25,30.07
N$20
  Top 0.152: JETSON.CATHODE 38.44,25.98
  Top 0.2: JETSON.CATHODE R10.2
N$21
  Bottom 0.152: U1.26 15.38,20.41 C4.1
N$22
  Bottom 0.152: C5.1 17.08,23.03 16.2,22.15 14.7,22.15 13.96,21.41 U1.28
N$23
  Bottom 0.152: U1.29 13.86,21.91 14.35,22.4 14.35,22.7 14.68,23.03 C5.2
N$24
  Bottom 0.152: U1.5 14.41,9.91 14.94,10.44 R35.1
N$25
  Bottom 0.152: U1.4 15.45,9.41 C9.2
N$26
  Bottom 0.152: U1.3 14.09,8.91 14.95,8.05 C8.2
N$27
  Bottom 0.152: U1.17 13.84,15.91 14.7,15.05 14.7,13.05 15.58,12.17 R8.2
N$28
  Bottom 0.152: 15.57,14.34 D1.ANODE 16.56,13.4 17.05,13.4 17.35,13.1 17.35,12.17 R8.1 18.2,12.17 R23.2 18.28,10.63 C11.2
N$29  (via drill 0.35)
  Top 0.152: U$11.3 62.7,36.55 62.4,36.85 60.95,36.85 60.1,36 D6.A 59.5,34.7 57.6,34.7 57.35,34.45 R21.1 57.35,34.95 v57.1,35.2
  Bottom 0.152: R55.2 60.75,35.2 v57.1,35.2
N$30
  Top 0.152: R24.2 59.6,38.2 D6.K 60.1,37 59.4,36.3 58.54,36.3 U$20.2 58.27,36.1 57.4,36.1
N$31
  Top 0.152: U$20.4 54.85,37.28 R25.1
N$32
  Top 0.152: 63.85,32.9 R37.1 63.95,33 64.6,33 64.86,33.26 64.86,34.36 66.2,35.7 66.2,36.95 3.I/O
N$33
  Top 0.152: U$21.6 61.4,33.9 61.6,34.1 62.2,34.1 | U$21.5 62.05,33.95 62.2,34.1 | R53.1 63.6,34.1 62.2,34.1
N$34
  Top 0.152: U$14.2 58.76,40.76 60,42 D3.K 59.4,42.7 R27.2
N$35
  Top 0.152: R29.1 54.57,41.71 U$14.4
N$36  (via drill 0.35)
  Top 0.152: v58.5,30 R26.1 59.25,30.15 D2.A 60.6,31 60.8,31.2 60.8,31.77 60.91,31.87 60.91,31.91 61.2,32.2 62.4,32.2 62.7,31.9 U$21.3
  Bottom 0.152: R56.2 58.5,29.4 v58.5,30
N$37
  Top 0.152: R31.2 59.5,34 D2.K 60.1,33 60.6,32.5 60.6,32.2 60.1,31.7 59.6,31.7 59.4,31.91 U$23.2
N$38
  Top 0.152: R32.1 54.62,32.85 U$23.4
N$39
  Bottom 0.152: R19.1 73.64,28.11 R17.2 74.8,27.11 74.8,18.6 73.41,17.2 72.69,17.2 72,17.9 72,20.7 U$28.3
N$40  (via drill 0.35)
  Top 0.152: U2.32 52.5,4.52 v52.5,5.2
  Bottom 0.152: v52.5,5.2 52.5,2.5 27.TP
N$41
  Bottom 0.152: JP2.2 71.49,27.39 71.2,27.1 71.2,25.6 71.3,25.5 73.2,25.5 73.3,25.6 73.83,25.07 R14.2 73.62,24.89 R19.2
N$42  (via drill 0.35)
  Top 0.152: v23.9,31.3 23.23,31.97 IC4.6
  Bottom 0.152: 47.77,30.38 R33.2 47.85,30.9 45.3,30.9 44.6,30.2 25.6,30.2 24.5,31.3 v23.9,31.3
N$43  (via drill 0.35)
  Top 0.152: v26.1,32.1 24.9,32.1 23.88,33.12 IC4.7
  Bottom 0.152: R34.2 26.25,31.95 v26.1,32.1
N$44
  Top 0.152: R28.1 65.97,42.25 1.I/O
N$45  (via drill 0.35)
  Top 0.152: v66.1,12.7 60.7,12.7 v58.4,15 | v56.9,16.8 58.6,18.5 63.6,18.5 v63.8,18.3
  Bottom 0.152: 61.4,22.8 59.3,22.8 58.8,23.3 R52.1 58.7,26.5 R51.2 | 61.4,22.8 61.6,22.8 | IC3.15 67.61,12.7 v66.1,12.7 | v58.4,15 56.9,16.5 v56.9,16.8 | 61.4,22.8 63.5,20.7 63.5,18.6 v63.8,18.3
N$46
  Top 0.152: U$21.2 62.05,30.85 62.2,30.7 62.25,30.7 R39.2 62.89,30.2 63.76,31.07 63.76,31.71 R37.2
N$47
  Bottom 0.152: C23.2 70,22.8 IC5.4
N$48
  Bottom 0.152: IC5.1 67.3,25.35 67.3,24.7 67.6,24.4 68.75,24.4 69.12,24.77 69.12,25.38 | 69.05,25.3 69.12,25.38 | 69.12,25.38 IC5.3 69.15,26.1 | 69.15,26.1 69.15,26.55 C10.2 | D5.1 68.4,28.4 69,27.8 69,26.25 69.15,26.1
N$49
  Top 0.152: RC_PWR.CATHODE R42.2
N$50
  Bottom 0.152: R22.2 14.83,16.12 14.15,16.8 14.15,17.2 13.94,17.41 U1.20
N$51  (via drill 0.35)
  Top 0.152: U2.21 25.71,3.21 v23.9,1.4
  Bottom 0.152: 16.TP 23.31,1.6 23.37,1.54 23.76,1.54 v23.9,1.4
N$52  (via drill 0.35)
  Top 0.152: v28.65,14.5 28.2,14.95 25.79,14.95 U2.D1
  Bottom 0.152: J2.3 29.36,13.79 v28.65,14.5
N$53
  Bottom 0.152: 49.7,30.65 R33.1 49.75,30.6 | U$5.1 49.75,30.6 | R47.1 49.7,30.55 49.75,30.6
N$54
  Bottom 0.152: 48.82,31.91 R34.1 | R34.1 49.76,31.95 50.1,32.3 50.1,33.8 50.7,34.41 U$5.4 | R34.1 48.8,31.98 R48.1
N$55  (via drill 0.35)
  Top 0.2: U2.20 25.87,24.57 30.4,29.1 32.7,29.1 33.3,29.7 33.3,32.6 41.3,40.6 v44.1,40.6
  Bottom 0.152: U$8.7 51.3,40.44
  Bottom 0.2: U$8.7 51.47,40.6 v44.1,40.6
N$56  (via drill 0.35)
  Top 0.2: U2.19 28.41,24.91 31,27.5 34.1,27.5 35.2,28.6 35.2,31.8 42.8,39.4 v48.7,39.4
  Bottom 0.2: v48.7,39.4 48.77,39.47 U$8.6
N$57
  Bottom 0.152: U$8.1 63.09,42.01 R49.2 R43.1
N$58
  Bottom 0.152: R44.1 57.5,36.4 R50.2 | R50.2 58.6,36.5 | R50.2 58.7,37 58.5,37.2 54.9,37.2 54.4,37.7 54.4,40 55,40.6 58.3,40.6 60.7,38.2 U$8.4
N$59  (via drill 0.35)
  Top 0.152: R45.1 54.6,28.9 56.3,28.9 57.8,27.4 v57.8,27.1
  Bottom 0.152: U7.1 59.06,22.04 58.3,22.8 58.3,24.04 58.3,24.05 58.3,25 57.8,25.5 v57.8,27.1
N$60  (via drill 0.35)
  Top 0.152: U2.6 61.43,24.27 60.4,25.3 55.7,25.3 55.1,24.7 55.1,20.7 53.8,19.4 v53.2,19.4
  Bottom 0.152: U7.3 52.8,20.77 | 52.8,20.77 52.13,20.77 R46.2 | v53.2,19.4 53.2,20.36 52.8,20.77
N$61
  Top 0.152: U$9.5 62.1,43.2 62.2,43.3 | 62.2,43.3 63.15,43.3 R4.1 | 62.2,43.3 61.6,43.3 61.45,43.15 U$9.6
N$62  (via drill 0.35)
  Top 0.152: v48.5,26.4 46.3,26.4 45.2,27.5 45.2,28.5 44.5,29.2 43.4,29.2 42.9,28.7 42.9,25.3 v43,25.2
  Bottom 0.152: U3.2 51.8,26.39 51.8,26.4 v48.5,26.4 | v43,25.2 41.7,25.2 T2.3
N$63
  Bottom 0.152: R12.2 52.44,23.77 U3.1
N$64
  Bottom 0.152: 42,23.15 T2.1 | T2.1 42.15,22.05 41.6,21.5 40.4,21.5 R13.1 | T2.1 42.15,23.95 41.5,24.6 37.4,24.6 R2.2
N$65  (via drill 0.35)
  Top 0.152: U2.D3 33.29,10.36 v34,9.65
  Bottom 0.152: v34,9.65 34.44,9.21 J2.1
N$66
  Bottom 0.152: T1.3 44.69,15.29 U4.2
N$67
  Bottom 0.152: U4.1 47.16,14.02 48.2,15.05 R58.2
N$68
  Bottom 0.152: T1.1 41.75,17.3 R57.2 41.8,17.7 R59.1
OE_PIN  (via drill 0.35)
  Top 0.2: U2.10 51.27,25.33 47.65,28.95 47.15,28.95 41.4,34.7 v41.4,35.1 | v29.4,39.8 23.7,39.8 23.23,40.27 IC4.23
  Bottom 0.152: v29.4,39.8 29.4,39.87 R3.2
  Bottom 0.2: v41.4,35.1 41.3,35.1 36.6,39.8 v29.4,39.8
PICO_5V  (via drill 0.35)
  Top 0.152: v49.45,13.75 47.2,11.5 41.4,11.5 40.4,10.5
  Top 0.406: D10.1 16.4,31.95 18.85,31.95 22.52,28.27 23.5,27.3 23.5,19.7 25.1,18.1 32.8,18.1 40.4,10.5 43.28,7.62 55.67,7.62 57.45,9.4 65.05,9.4 68.55,5.9 70.1,5.9 71.7,4.3 71.7,2.5 71.6,2.5 71.59,2.51 U2.39
  Bottom 0.152: R12.1 50.1,24.3 50.1,20.75 50.85,20 50.85,19.3 49.8,18.25 R58.1 49.8,14.1 v49.45,13.75
PICO_RX  (via drill 0.35)
  Top 0.2: U2.2 71.59,20.59 70.1,19.1 57.8,19.1 54,15.3 54,13.6 50.4,10 v49.1,10
  Bottom 0.2: v49.1,10 47.6,10 46.9,9.3 J1.2
PICO_TX  (via drill 0.35)
  Top 0.152: 74.13,19.23 73.4,18.5 65.1,18.5 64.1,17.5 60.3,17.5 59.9,17.9 59.1,17.9
  Top 0.2: v51.85,8.65 56,12.8 56,14.8 59.1,17.9 | U2.1 74.13,19.23
  Bottom 0.2: J1.3 44.36,4.34 44.9,3.8 50,3.8 52,5.8 52,8.5 v51.85,8.65
RC_+B_3V3  (via drill 0.35)
  Top 0.152: 55.72,39.72 56.9,38.53 56.9,36.38 U$20.5 55.91,35.2 55.5,34.8 55.5,33.9 55.9,33.5 56.6,33.5 57,33.1 57,31.2 56.73,30.93 56.02,30.93 | 55.72,39.72 U$14.5 55.62,40.27 55.3,40.6 53.2,40.6 RC_3V3.TP | 56.59,40.59 55.72,39.72 | 56.02,30.93 56.2,30.75 56.2,30 58,28.2 60.34,28.2 v61.21,29.08 | v72.8,30.1 72.76,30.14 72.8,30.18 72.8,31.85 72.15,32.5 v70,32.5 | U$23.5 56.02,30.93 | C17.2 62.8,28.8 64.04,30.04 v64.04,30.47
  Bottom 0.152: 62.51,30.9 U$5.8 | U$5.8 62.4,30.59 | 62.4,30.59 62.7,30.59 | 64.4,30.47 v64.04,30.47 | v64.04,30.47 62.52,30.47 62.4,30.59 | JP2.1 72.51,29.81 v72.8,30.1 | v64.04,30.47 64.04,30.84 65.7,32.5 v70,32.5 | R18.2 73.87,21.73 R11.2 | R11.2 71.5,19.68 71.5,18.1 71.1,17.7 70.3,17.7 69,16.4 69,12.6 68.5,12.1 67.66,12.1 IC3.16 67.2,11.64 C3.2 66.55,11.65 61.65,11.65 60.55,10.55 60.55,10.15 60.2,9.8 55.4,9.8 C12.2 52.29,12.91 U4.4 | U3.4 59.9,23.77 | 59.9,23.77 60.69,23.77 60.74,23.72 60.78,23.72 61,23.5 63.6,23.5 | C1.2 61.4,24.5 60.5,24.5 59.9,23.9 59.9,23.77 | C22.2 66,23.5 66.55,22.95 67.1,22.95 IC5.5 67.25,22.45 65.9,21.1 64.5,21.1 64.1,21.5 | 64.1,21.5 63.6,22 63.6,23.5 | v61.21,29.08 61.21,29.61 U$5.8 | R11.2 67.11,19.4 64.4,19.4 64.1,19.7 64.1,21.5 | v64.04,30.47 64,30.43 64,27.9 64.6,27.3 64.6,26.5 64.1,26 64.1,24 63.6,23.5
  Bottom 0.2: C12.2 52.85,12.35
RC_GND  (via drill 0.35)
  Top 0.152: 3.GND 71.26,36.74 72.05,35.95 v72.8,35.95 73.05,35.95 v73.95,35.05 74.25,35.05 74.8,34.5 74.8,30 74.65,29.85 | v73.95,37.1 v73.95,38.95 | v72.6,38.25 72.75,38.25 73.45,38.95 v73.95,38.95 | v73.95,38.95 v73.95,40.8 | v73.95,40.8 73.9,40.75 v72.55,40.75 | v73.95,40.8 v73.95,42.6 73.95,43.65 R42.1 | U$20.3 58.25,37.54 R24.1 58.2,38.2 58.2,38.3 | 57.1,41.4 57.4,41.7 U$14.3 58.23,42.62 R27.1 58.15,42.75 58.7,43.3 60.2,43.3 60.8,42.7 60.8,42.3 61.1,42 62.6,42 62.8,42.2 62.8,42.7 U$9.4 | 57.1,41.4 57.1,39.2 58,38.3 58.2,38.3 | R40.1 61.45,35.85 U$11.1 | v58.9,39.03 58.2,38.34 58.2,38.3 | R31.1 58.25,33.2 U$23.3 59.34,32.85 v59.8,32.4 | v57.15,42.8 57.12,42.77 | 57.12,42.77 57.1,42.75 57.1,41.4 | 61.4,34.8 R40.1 | U$9.1 61.45,39.7 R38.1 | U$11.4 62.52,38.18 62.52,38.7 62.02,39.2 61.95,39.2 R38.1 | R38.1 61.4,39.6 v60.84,39.04 | R40.1 61.04,34.39 v60.61,34.39 60.9,34.1 60.9,32.9 61.1,32.7 62.4,32.7 62.7,33 U$21.4 62.75,33.45 | R39.1 61.58,30.12 61.9,29.8 61.9,27.6 v61.6,27.3 61.7,27.2 C17.1 62.9,27 62.9,26.5 63.5,25.9 66.3,25.9 68.1,27.7 | v68,27.7 68.1,27.7 | 68.1,27.7 69.3,27.7 70.35,26.65 v70.35,26.15 | v68,27.7 67.5,27.2 | 59.79,16.8 59.79,15.11 61.4,13.5 67.5,13.5 68.6,12.4 | 59.79,16.8 v59.79,16.89 59.09,16.89 57,14.8 57,10.7 v57.2,10.5 | v68,27.7 67.1,28.6 v67.1,29.2 | v69,29.3 70.5,29.3 | 70.5,29.3 71.7,29.3 72.1,28.9 73.7,28.9 74.65,29.85 | v68.9,9.7 68.6,10 68.6,12.4 | 68.6,12.4 68.8,12.4 69.1,12.7 69.1,16.4 69.8,17.1 71.8,17.1 71.6,17.3 64.8,17.3 64.3,16.8 59.79,16.8 | v74.65,28.9 74.65,29.85 | TH.GND 71.26,30.06 70.5,29.3 | R54.1 55.73,42.77 57.12,42.77 | 63.95,35.9 v64.04,35.9
  Top 0.152: v53.65,38.05 53.6,38 v53.6,36.34
  Top 0.2: U$21.1 61.35,31.25 61.35,30.5 R39.1
  Bottom 0.152: 60.63,34.41 v60.61,34.39 | v60.61,34.39 60.65,34.35 60.65,33.25 v59.8,32.4 59.8,33.7 59.05,34.45 55.49,34.45 v53.6,36.34 | v58.9,39.03 58.33,39.6 55.3,39.6 54.95,39.25 54.95,38.2 55.45,37.7 59.15,37.7 60.3,36.55 R50.1 63.25,36.4 63.75,35.9 v64.04,35.9 64.1,35.9 | 60.97,40.73 U$8.2 U$8.3 61.27,39.47 v60.84,39.04 60.71,39.04 58.55,41.2 54.55,41.2 53.75,40.4 53.75,38.15 v53.65,38.05 | R49.1 64.3,42.5 | 64.3,42.5 64.3,42.7 | 1.GND 69.7,43.6 68.1,43.6 67.45,42.95 67.45,35.9 66.9,35.35 64.65,35.35 64.1,35.9 | 63.6,43.2 64.3,42.5 | 63.6,43.2 58.7,43.2 58.3,42.8 v57.15,42.8 | U$5.5 62.3,34.51 R55.1 | ST.GND | U$5.5 63.4,34.41 63.9,34.91 63.9,35.7 64.1,35.9 | 63.9,43.5 63.85,43.45 | 63.85,43.45 63.6,43.2 | C23.1 70.5,26 v70.35,26.15 | 68.2,25.9 IC5.2 68.2,26.3 67.8,26.7 C10.1 | IC3.8 61.15,16.7 | 61.15,16.7 62.5,16.7 62.9,17.1 62.9,20.25 v62.75,20.4 62.38,20.77 U7.2 58.84,20.77 57.3,22.3 57.3,25.1 57.1,25.3 57.1,27.9 57.6,28.4 57.65,28.4 | C22.1 67.2,26.9 C10.1 | C10.1 67.4,27.1 v68,27.7 | v59.79,16.89 59.99,16.7 61.15,16.7 | R16.1 59.25,10.46 57.24,10.46 v57.2,10.5 | 57.65,28.4 59.5,28.4 R51.1 61.3,27.6 v61.6,27.3 62.55,27.3 62.7,27.15 62.7,26.5 R36.2 C1.1 | v69,29.3 68.9,29.2 v67.1,29.2 | 63.85,43.45 63.85,47.55 64.25,47.95 v64.25,48.3 64.75,48.8 v69.55,48.8 71.45,48.8 71.5,48.75 | 71.5,48.75 v71.55,48.7 73.25,48.7 v73.75,48.2 73.95,48 73.95,47.2 v74.35,46.8 74.45,46.7 v74.45,44.9 73.95,44.4 v73.95,42.6 73.45,43.1 v72.8,43.1 | C3.1 68.8,9.8 v68.9,9.7 | v70.6,47.8 70.6,47.85 71.5,48.75 | R56.1 57.65,28.4 | v60.61,34.39 62.18,34.39 U$5.5 | 55.77,12.42 55.73,12.45 C12.1 54.35,13.57 R60.2
  Bottom 0.2: 55.77,12.42 56.7,11.48 58.23,11.48 59.25,10.46
  Bottom 0.813: 1.GND 2.GND 3.GND ST.GND
  pour Top (rank 6, no thermals): 63.75,44.2 63.75,49.7 64.1,50.05 73.55,50.05 75.5,48.1 75.5,9.85 75,9.35 68.85,9.35 68.8,9.3 68.5,9.6 68.5,10 66.35,12.15 65,12.15 64.7,12.45 61.95,12.45 59.4,9.9 57.35,9.9 56.9,10.35 56.9,14.7 58.05,15.85 58.05,24.85 57.15,25.75 57.15,28.05 56.3,28.9 54.5,28.9 54.3,29.1 53.35,29.1 53.25,29.2 53,29.2 52.7,29.5 52.7,31.35 54.55,33.2 54.55,34.2 53.1,35.65 53,35.65 52.8,35.85 52.35,35.85 51.9,36.3 51.9,36.55 52.65,37.3 52.8,37.3 53.15,37.65 53.15,42.15 53.35,42.15 54.35,43.15 56.9,43.15 56.95,43.2 58.55,43.2 58.6,43.25 62.8,43.25
  pour Bottom (rank 6, no thermals): 51.85,36.65 51.85,36.9 53.5,38.55 53.5,42.3 54.4,43.2 63.1,43.2 63.7,43.8 63.7,49.7 64.05,50.05 73.35,50.05 75.45,47.95 75.45,9.55 75.05,9.15 68.75,9.15 68.5,9.4 68.5,9.95 67.75,10.7 66.85,10.7 65.8,11.75 62,11.75 59.95,9.7 56.95,9.7 54.4,12.25 54.4,15.6 55.85,17.05 57.2,17.05 57.3,17.15 57.3,20.3 55.95,21.65 55.95,29.5 55.8,29.65 55.8,33.1 53.05,35.85 52.65,35.85
RCH1
  Bottom 0.152: U$28.2 70.25,18.6 69.05,17.4 66.7,17.4 63.7,14.4 63.7,14.3 63.44,14.04 IC3.4
RCH2
  Bottom 0.152: U$27.2 63.94,15.98 IC3.7
SCL  (via drill 0.35)
  Top 0.152: v14.16,12.61 16.31,12.61 17.5,13.8 17.5,25.17 17.5,27.8 v19.5,29.8 | IC4.26 21.28,42.52 20.7,43.1 19.8,43.1 18.84,44.06 IC2.5 | v44.9,19.9 46.19,21.19 U2.12
  Bottom 0.152: v10.75,14.4 10.85,14.4 11.35,13.9 U1.13 13.94,13.91 14.16,13.69 v14.16,12.61 | IC2.5 18.84,30.46 v19.5,29.8 20.65,28.65 20.65,23.75 | v44.9,19.9 43.6,18.6 37.35,18.6 | R7.2 20.65,23.75 | 20.65,23.75 20.7,23.7 20.7,22.3 24.4,18.6 37.35,18.6 | 67.5,9.5 I2C.SCL 66.5,9.8 66.5,10.45 66.2,10.75 62.8,10.75 62.5,10.45 62.5,7.15 61.8,6.45 61.8,3.35 60.4,1.95 57.75,1.95 57.05,2.65 57.05,6 54.75,8.3 54.75,9.55 52.8,11.5 52.3,11.5 51,12.8 43.1,12.8 41.95,13.95 41.95,15.3 40.75,16.5 39.4,16.5 37.35,18.55 37.35,18.6
SDA  (via drill 0.35)
  Top 0.152: v9.65,13.2 8.7,14.15 8.7,20.4 6.7,22.4 6.7,26.45 8.25,28 v15,28 15,28.1 v16.9,30 | IC4.27 20.63,42.17 20.2,42.6 18.27,42.6 IC2.3 | v62.7,5.35 63.05,5.7 64.13,5.7 64.6,6.17 v64.6,6.5 | U2.11 48.73,19.83 46.3,17.4 44.4,17.4 41.7,14.7 v39.9,14.7
  Bottom 0.152: v9.65,13.2 11.45,13.2 | U1.12 11.66,13.41 11.45,13.2 | U1.11 11.74,12.91 11.45,13.2 | 16.3,43.95 IC2.3 16.3,30.61 v16.9,30 17.1,29.8 17.1,29.4 18.75,27.75 18.79,27.75 19.3,27.24 19.3,20.5 23.5,16.3 38.3,16.3 v39.9,14.7 39.9,14.55 42.85,11.6 50.65,11.6 56.45,5.8 56.45,2.5 57.45,1.5 60.55,1.5 62.8,3.75 62.8,5.25 v62.7,5.35 | 14.28,25.43 R9.2 14.45,25.96 14.45,27.45 v15,28 | v64.6,6.5 64.6,6.7 65.5,7.6 I2C.SDA
SEL
  Bottom 0.152: IC3.1 59.35,12.09 R16.2 57.04,12.06 55.9,13.2 55.9,14.2 54.9,15.2 53.58,15.2 53.4,15.02 | U4.3 52.29,15.26 52.33,15.3 52.95,15.3 53.23,15.02 53.4,15.02 | R60.1 53.4,15.02
VCC_RC  (via drill 0.35)
  Top 0.152: R4.2 64.65,43.3 67.2,43.3 68.45,42.05 1.VCC 70.3,43.62 70.3,46.5 70.9,47.1 72.8,47.1 73,46.9 RC_PWR.ANODE | 56.4,34.4 R21.2 56.3,34.4 57.6,33.1 57.6,29.6 58.2,29 59.58,29 v59.7,29.12 60.35,29.77 R26.2 | R15.2 R6.2 64.95,40.8 67.42,40.8 2.VCC 68.72,39.32 67.7,38.3 65.6,38.3 64.8,37.5 64.8,35.35 R53.2 | v65.6,29.5 65.3,29.5 63.9,28.1 v63.9,26.9
  Top 1.27: TH.VCC ST.VCC
  Bottom 0.152: 68.3,30.84 TH.VCC 68.9,31.25 | JP2.3 70.2,29.05 70.2,30.1 69.05,31.25 68.9,31.25 | v65.6,29.5 66.4,29.5 67,30.1 67.75,30.1 68.9,31.25 | v59.7,29.12 60.08,29.12 60.9,28.3 62.28,28.3 D5.2 62.8,28.4 63.2,28 63.2,27.61 v63.9,26.9
  Bottom 1.27: 1.VCC 2.VCC 3.VCC ST.VCC | TH.VCC 68.72,31.64

## Text on the board
tPlace: Designed in Aizu | REV 3.0.0 | RC | #612 | Jetson | C | R
bPlace: S/N | F-612-3-00-A-N-J-2-P | GND | RX | GND | TX | SWCLK | SWIDO
Document: Y | Raspberry Pi Pico AREA | X | O | Not Use | Not Use | #612 JetRacer Rev3.0.0 B | SWD | SERIAL
tDocu: OLED AREA | RX | TX | GND | SWCLK | GND | SWDIO